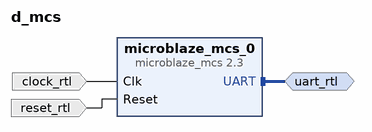
[diagram p0: block diagram of the top level]
# Vivado block design d_mcs, Vivado 2015.4_AR67478_AR66782_AR66772_AR66092_AR65813_ar68397_cr964221_2015_4
create_bd_design d_mcs

create_bd_intf_port -mode Master -vlnv xilinx.com:interface:uart_rtl:1.0 uart_rtl
create_bd_port -dir I -type clk clock_rtl
set_property -dict {CONFIG.FREQ_HZ 100000000 CONFIG.PHASE 0.000} [get_bd_ports clock_rtl]
create_bd_port -dir I -type rst reset_rtl
set_property -dict {CONFIG.POLARITY ACTIVE_HIGH} [get_bd_ports reset_rtl]

create_bd_cell -type ip -vlnv xilinx.com:ip:microblaze_mcs:2.3 microblaze_mcs_0
set_property -dict [list \
  CONFIG.MEMSIZE 65536 \
  CONFIG.USE_UART_RX 1 \
  CONFIG.USE_UART_TX 1 \
  CONFIG.UART_BAUDRATE 115200 \
] [get_bd_cells microblaze_mcs_0]

# ---- connections ----

connect_bd_intf_net [get_bd_intf_ports uart_rtl] [get_bd_intf_pins microblaze_mcs_0/UART]
connect_bd_net [get_bd_ports clock_rtl] [get_bd_pins microblaze_mcs_0/Clk]
connect_bd_net [get_bd_ports reset_rtl] [get_bd_pins microblaze_mcs_0/Reset]

validate_bd_design
save_bd_design
